# EAGLE design eeZeePower (EAGLE 7.1.0)
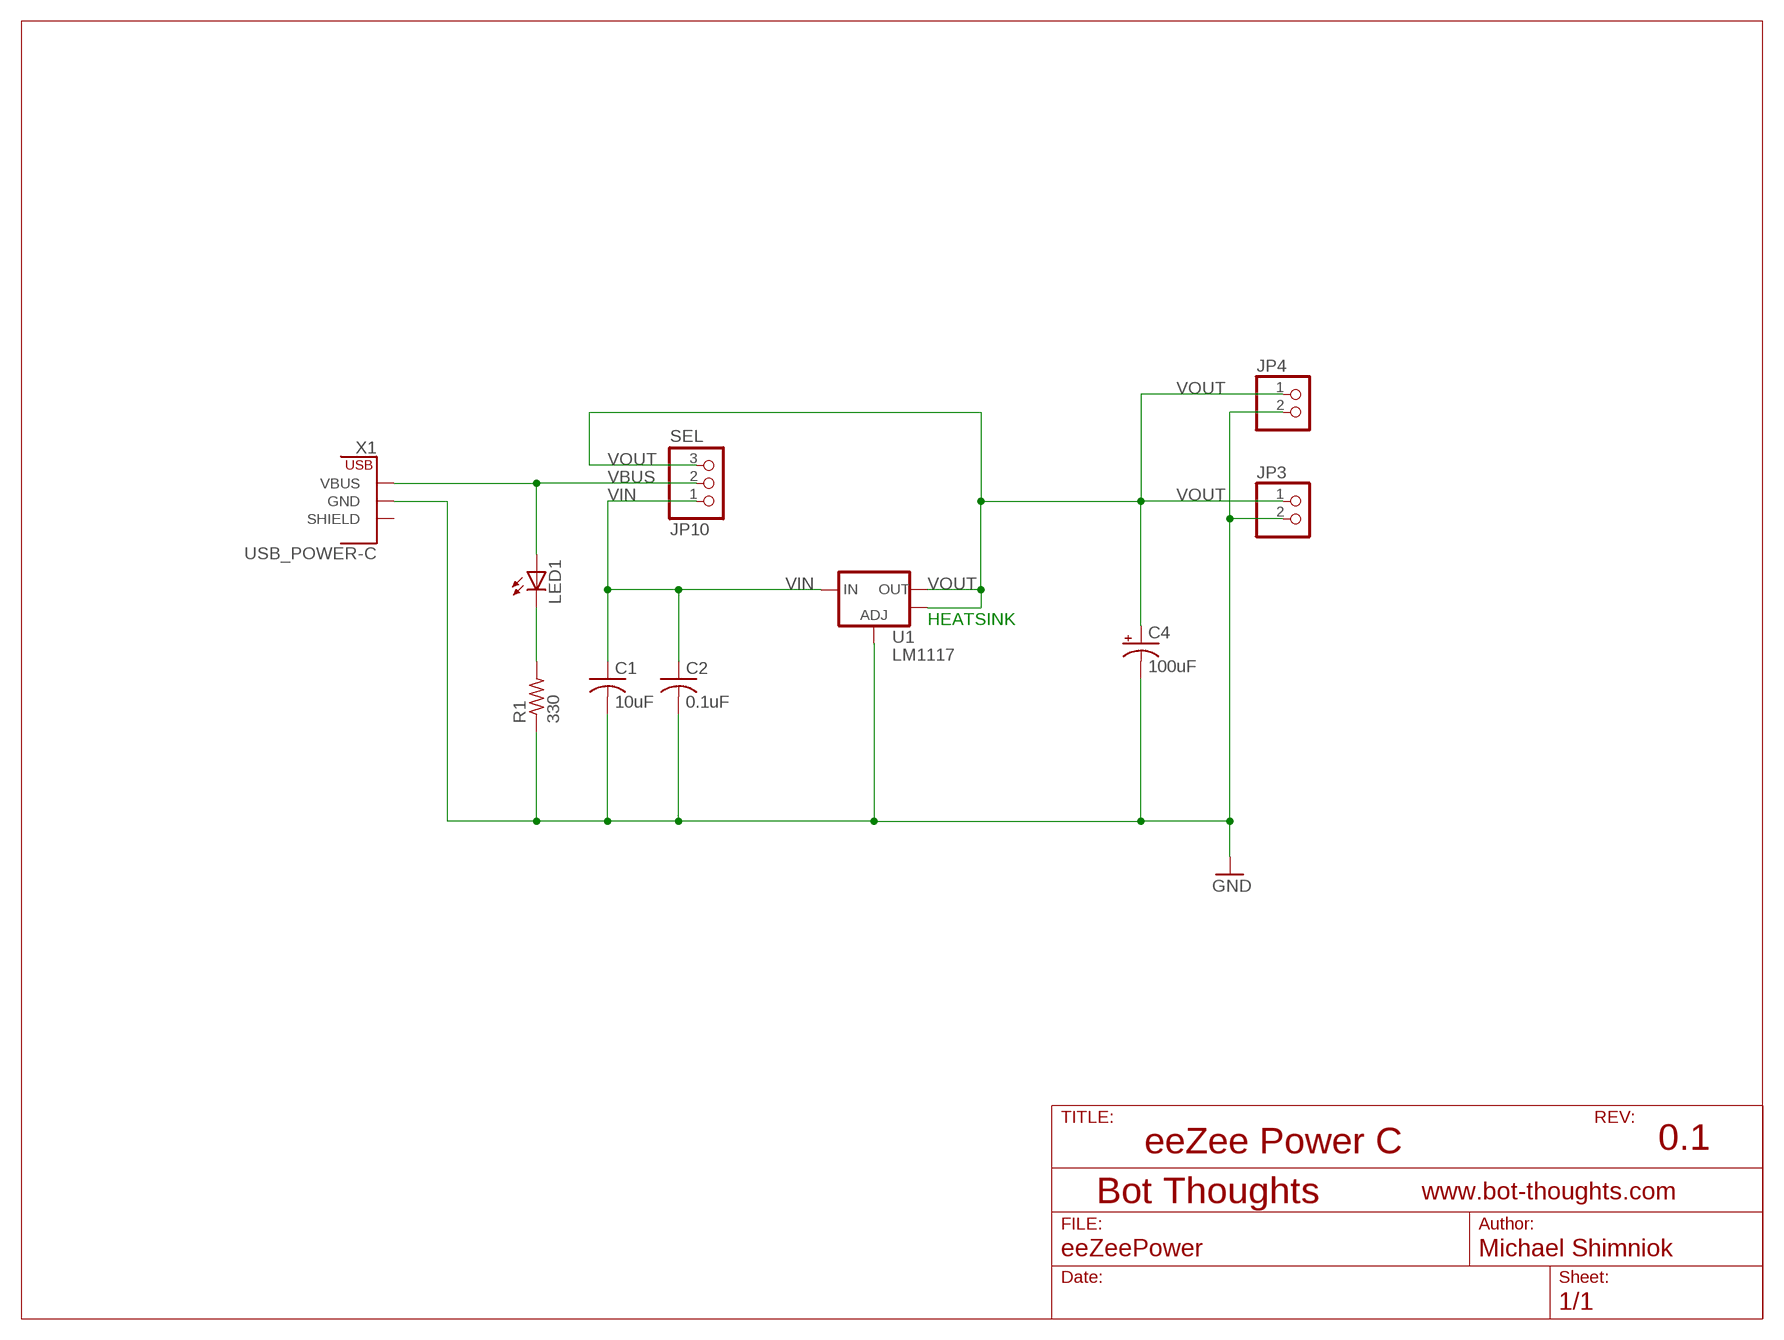
[diagram p0: schematic, sheet 1]

## Parts
C1  10uF  C-USC1206  [C1206]
C2  0.1uF  C-USC0603  [C0603]
C4  100uF  CPOL-USSMCB  [SMC_B]
JP3  PINHD-1X02_2.54-S  [1X02-S]
JP4  PINHD-1X02_2.54-S  [1X02-S]
JP10  SEL  PINHD-1X03_2.54-S  [1X03-S]
LED1  LEDCHIPLED_1206  [CHIPLED_1206]
R1  330  R-US_R0603  [R0603]
U1  LM1117  V_REG_LM1117SOT223  [SOT223]
X1  USB_POWER-C  [USB-C-PWR]

## Nets
GND: C1.2 C2.2 C4.- JP3.2 JP4.2 R1.1 U1.1(ADJ) X1.A12(GND) X1.B12(GND)
N$5: LED1.C R1.2
VBUS: JP10.2 LED1.A X1.A9(VBUS) X1.B9(VBUS)
VIN: C1.1 C2.1 JP10.1 U1.3(IN)
VOUT: C4.+ JP3.1 JP4.1 JP10.3 U1.2(OUT) U1.4(OUT)
Unconnected: X1.SHIELD1(SHIELD) X1.SHIELD2(SHIELD) X1.SHIELD3(SHIELD) X1.SHIELD4(SHIELD)

## Notes on the sheet
- HEATSINK
- eeZee Power C | 0.1

## Library data of the parts
C1 C2 = rcl:C-US: CAPACITOR, American symbol
C4 = rcl:CPOL-US: POLARIZED CAPACITOR, American symbol
JP3 JP4 = pinhead-2:PINHD-1X02: PIN HEADER
JP10 = pinhead-2:PINHD-1X03: PIN HEADER
LED1 = led:LED: LED OSRAM: - CHIPLED LG R971, LG N971, LY N971, LG Q971, LY Q971, LO R971, LY R971 LH N974, LH R974 LS Q976, LO Q976, LY Q976 LO Q996 - Hyper CHIPLED LW Q18S LB Q993, LB Q99A, LB R99A - SideLED LS A670, LO A670, LY A670, LG A670, LP A670 LB A673, LV A673, LT A673, LW A673 LH A674 LY A675 LS A676, LA A676, LO A676, LY A676, LW A676 LS A679, LY A679, LG A679 - Hyper Micro SIDELED® LS Y876, LA Y876, LO Y876, LY Y876 LT Y87S - SmartLED LW L88C, LW L88S LB L89C, LB L89S, LG L890 LS L89K, LO L89K, LY L89K LS L896, LA L896, LO L896, LY L896 - TOPLED LS T670, LO T670, LY T670, LG T670, LP T670 LSG T670, LSP T670, LSY T670, LOP T670, LYG T670 LG T671, LOG T671, LSG T671 LB T673, LV T673, LT T673, LW T673 LH T674 LS T676, LA T676, LO T676, LY T676, LB T676, LH T676, LSB T676, LW T676 LB T67C, LV T67C, LT T67C, LS T67K, LO T67K, LY T67K, LW E67C LS E67B, LA E67B, LO E67B, LY E67B, LB E67C, LV E67C, LT E67C LW T67C LS T679, LY T679, LG T679 LS T770, LO T770, LY T770, LG T770, LP T770 LB T773, LV T773, LT T773, LW T773 LH T774 LS E675, LA E675, LY E675, LS T675 LS T776, LA T776, LO T776, LY T776, LB T776 LHGB T686 LT T68C, LB T68C - Hyper Mini TOPLED® LB M676 - Mini TOPLED Santana® LG M470 LS M47K, LO M47K, LY M47K Source: http://www.osram.convergy.de LUXEON: - LUMILED® LXK2-PW12-R00, LXK2-PW12-S00, LXK2-PW14-U00, LXK2-PW14-V00 LXK2-PM12-R00, LXK2-PM12-S00, LXK2-PM14-U00 LXK2-PE12-Q00, LXK2-PE12-R00, LXK2-PE12-S00, LXK2-PE14-T00, LXK2-PE14-U00 LXK2-PB12-K00, LXK2-PB12-L00, LXK2-PB12-M00, LXK2-PB14-N00, LXK2-PB14-P00, LXK2-PB14-Q00 LXK2-PR12-L00, LXK2-PR12-M00, LXK2-PR14-Q00, LXK2-PR14-R00 LXK2-PD12-Q00, LXK2-PD12-R00, LXK2-PD12-S00 LXK2-PH12-R00, LXK2-PH12-S00 LXK2-PL12-P00, LXK2-PL12-Q00, LXK2-PL12-R00 Source: www.luxeon.com KINGBRIGHT: KA-3528ASYC Source: www.kingbright.com
R1 = resistor:R-US_: RESISTOR, American symbol
U1 = SparkFun:V_REG_LM1117: Voltage Regulator LM1117 Standard adjustable voltage regulator but in SMD form. Spark Fun Electronics SKU : COM-00595
X1 = bt_electromech:USB_POWER: USB Power-Only Connector USB connector used only for power exposing VBUS, GND, SHIELD pins only

## Board
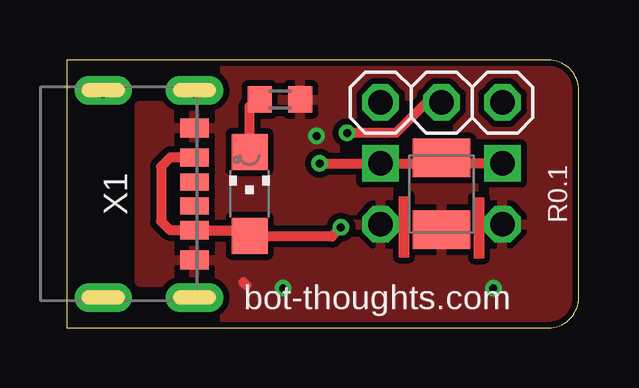
[diagram p1: board, top side]
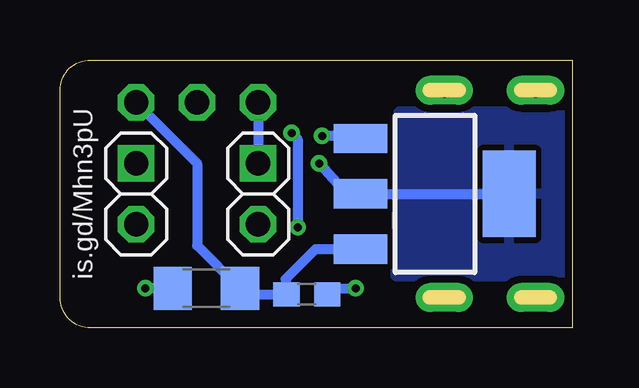
[diagram p2: board, bottom side, seen from below]

Size 21.34 x 11.18 mm. Coordinates in mm from the lower left corner, seen from the top.
Outline: 0,0 20.07,0 arc90 21.34,1.27 21.34,9.91 arc90 20.07,11.18 0,11.18 0,0
Copper layers (1*16): Top 0.0356mm / dielectric 1.5011mm / Bottom 0.0356mm
Design rules "LaenPCBOrder *": minimum track width 6mil, minimum drill 13mil, track to track 10mil, track to pad 10mil, pad to pad 10mil, via to via 10mil, smd to smd 8mil, copper to edge 10mil, drill to drill 10mil, minimum pad ring 7mil, minimum via ring 7mil, stop-mask expansion 3mil, vias tented up to drill 20mil, thermal gap 10mil

### Footprints (pad centres in the part's own frame; a part is rotated, then mirrored left to right if it is on the bottom)
C1206 = smd 1.6 x 1.8: 1 -1.4,0; 2 1.4,0
C0603 = smd 1.1 x 1: 1 -0.85,0; 2 0.85,0
SMC_B = smd 1.6 x 2.4: + -1.5,0; - 1.5,0
1X02-S = drill 1.016 square: 1 -1.27,0 | drill 1.016 octagon: 2 1.27,0
1X03-S = drill 1.016 octagon: 1 -2.54,0; 2 0,0; 3 2.54,0
CHIPLED_1206 = smd 1.5 x 1.5: A 0,-1.75; C 0,1.75
R0603 = smd 1 x 1.1: 1 -0.85,0; 2 0.85,0
SOT223 = smd 1.219 x 2.235: 1 -2.311,-3.099; 2 0,-3.099; 3 2.311,-3.099 | smd 3.6 x 2.2: 4 0,3.099
USB-C-PWR = smd 0.7 x 1.2: A5 -0.5,3.8; B5 0.5,3.8 | smd 0.76 x 1.2: A9 1.52,3.8; B9 -1.52,3.8 | smd 0.8 x 1.2: A12 2.75,3.8; B12 -2.75,3.8 | drill 0.6 pad 1.2 long: SHIELD1 -4.32,3.8; SHIELD2 4.32,3.8; SHIELD3 -4.32,0; SHIELD4 4.32,0

### Placement (x,y rotation side)
C1  15.24,1.65 180 bottom
C2  11.05,1.4 0 bottom
C4  15.62,5.59 270 top
JP3  13.08,5.59 270 bottom
JP4  18.16,5.59 270 bottom
JP10  15.62,9.4 180 top
LED1  7.62,5.59 0 top
R1  8.89,9.53 180 top
U1  5.71,5.59 270 bottom
X1  1.52,5.59 270 top

### Tracks (layer width: path | path; a pad name or v marks a point on that pad's centre or on a via)
GND  (via drill 0.33)
  Top 0.406: 7.49,1.78 7.37,1.91
  Bottom 0.406: C1.2 v17.78,1.65 | U1.1 8.91,8 v10.41,8 | C2.2 10.03,1.52 9.91,1.65 v9.02,1.65
  pour Top (rank 3): 3.05,9.27 5.46,9.27 5.46,11.18 20.07,11.18 arc-90 21.34,9.91 21.34,1.27 arc-90 20.07,0 5.46,0 5.46,1.91 3.05,1.91
N$5
  Top 0.406: LED1.C 7.62,9.23 R1.2
VBUS  (via drill 0.33)
  Top 0.406: X1.B9 4.33,7.11 3.94,6.72 3.94,4.45 4.32,4.07 X1.A9 7.39,4.07 LED1.A 7.65,3.81 11.05,3.81 v11.43,4.19 | JP10.2 14.99,9.4 13.72,8.13 v11.68,8.13
  Bottom 0.406: v11.68,8.13 11.43,7.87 v11.43,4.19
VIN
  Bottom 0.406: JP10.1 15.62,6.86 15.62,3.43 C1.1 13.59,1.65 13.34,1.4 C2.1 11.94,1.44 11.94,2.03 10.69,3.28 U1.3
VOUT  (via drill 0.33)
  Top 0.406: v10.54,6.86 JP3.1 15.39,6.86 C4.+ 15.85,6.86 JP4.1
  Bottom 0.406: v10.54,6.86 9.4,5.59 U1.2 U1.4 | JP10.3 JP3.1
  pour Bottom (isolate 0.305): 0.13,9.02 7.24,9.02 7.37,2.16 0.13,2.16
(copper drawn outside any net)
  shapes: Top area x2

### Text on the board
tPlace: R0.1 | bot-thoughts.com
bNames: is.gd/Mhn3pU
tValues: 3V3 | VU | VCC | GND | eeZeePowerC